# EAGLE design gflexgostack (EAGLE 6.5.0)
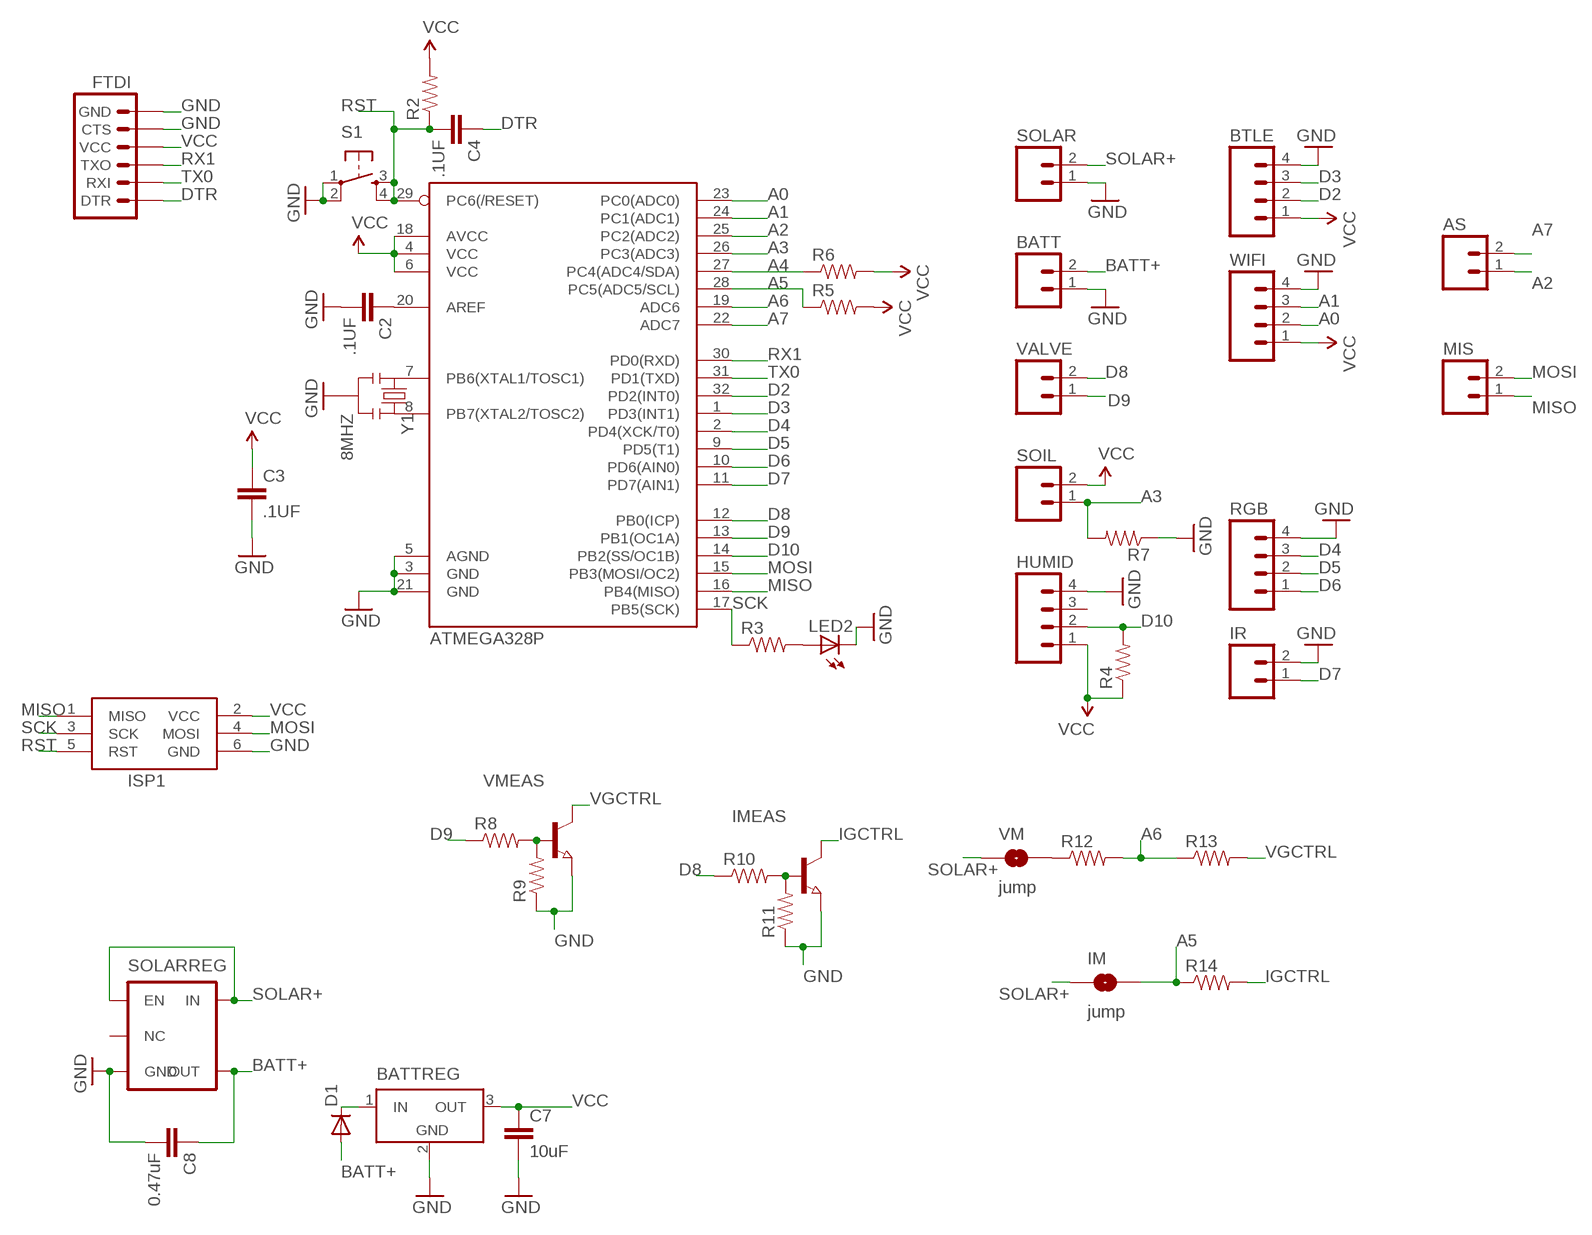
[diagram p0: schematic, sheet 1]

## Parts
AS  M02PTH  [1X02]
ATMEGA328P  ATMEGA168  [TQFP32-08]
BATT  M02PTH  [1X02]
BATTREG  LT1129CST5  [SOT223]
BTLE  M04PTH  [1X04]
C2  .1UF  .1UF-CER  [0402-CAP]
C3  .1UF  .1UF-CER  [0402-CAP]
C4  .1UF  .1UF-CER  [0402-CAP]
C7  10uF  .1UF-CER  [0402-CAP]
C8  0.47uF  .1UF-CER  [0402-CAP]
D1  DIODESMA  [SMA-DIODE]
FTDI  ARDUINO_SERIAL_PROGRAMPTH  [1X06]
HUMID  M04PTH  [1X04]
IM  jump  SOLDERJUMPERTRACE  [SJ_2S-TRACE]
IMEAS  NPN-TRANSISTOR_SOT23  [SOT23]
IR  M02PTH  [1X02]
ISP1  AVRISP-6  [AVRISP]
LED2  LED0603  [LED-0603]
MIS  M02PTH  [1X02]
R2  RESISTOR0603-RES  [0603-RES]
R3  RESISTOR0603-RES  [0603-RES]
R4  RESISTOR0603-RES  [0603-RES]
R5  RESISTOR0603-RES  [0603-RES]
R6  RESISTOR0603-RES  [0603-RES]
R7  RESISTOR0603-RES  [0603-RES]
R8  RESISTOR0603-RES  [0603-RES]
R9  RESISTOR0603-RES  [0603-RES]
R10  RESISTOR0603-RES  [0603-RES]
R11  RESISTOR0603-RES  [0603-RES]
R12  RESISTOR0603-RES  [0603-RES]
R13  RESISTOR0603-RES  [0603-RES]
R14  RESISTOR0603-RES  [0603-RES]
RGB  M04PTH  [1X04]
S1  TAC_SWITCHSMD  [TACTILE_SWITCH_SMD]
SOIL  M02PTH  [1X02]
SOLAR  M02PTH  [1X02]
SOLARREG  V_REG_MIC52195V  [SOT23-5]
VALVE  M02PTH  [1X02]
VM  jump  SOLDERJUMPERTRACE  [SJ_2S-TRACE]
VMEAS  NPN-TRANSISTOR_SOT23  [SOT23]
WIFI  M04PTH  [1X04]
Y1  8MHZ  RESONATOR8MHZ  [RESONATOR-SMD]

## Nets
A0: ATMEGA328P.23(PC0(ADC0)) WIFI.2
A1: ATMEGA328P.24(PC1(ADC1)) WIFI.3
A2: AS.1 ATMEGA328P.25(PC2(ADC2))
A3: ATMEGA328P.26(PC3(ADC3)) R7.2 SOIL.1
A4: ATMEGA328P.27(PC4(ADC4/SDA)) R6.1
A5: ATMEGA328P.28(PC5(ADC5/SCL)) IM.2 R5.1 R14.1
A6: ATMEGA328P.19(ADC6) R12.2 R13.1
A7: AS.2 ATMEGA328P.22(ADC7)
BATT+: BATT.2 C8.1 D1.A SOLARREG.4(OUT)
D2: ATMEGA328P.32(PD2(INT0)) BTLE.2
D3: ATMEGA328P.1(PD3(INT1)) BTLE.3
D4: ATMEGA328P.2(PD4(XCK/T0)) RGB.3
D5: ATMEGA328P.9(PD5(T1)) RGB.2
D6: ATMEGA328P.10(PD6(AIN0)) RGB.1
D7: ATMEGA328P.11(PD7(AIN1)) IR.1
D8: ATMEGA328P.12(PB0(ICP)) R10.1 VALVE.2
D9: ATMEGA328P.13(PB1(OC1A)) R8.1 VALVE.1
D10: ATMEGA328P.14(PB2(SS/OC1B)) HUMID.2 R4.2
DTR: C4.1 FTDI.1(DTR)
GND: ATMEGA328P.3(GND) ATMEGA328P.5(AGND) ATMEGA328P.21(GND) BATT.1 BATTREG.2(GND) BTLE.4 C2.2 C3.2 C7.2 C8.2 FTDI.5(CTS) FTDI.6(GND) HUMID.4 IMEAS.2(E) IR.2 ISP1.6(GND) LED2.C R7.1 R9.1 R11.1 RGB.4 S1.1 S1.2 SOLAR.1 SOLARREG.3(GND) VMEAS.2(E) WIFI.4 Y1.2
IGCTRL: IMEAS.3(C) R14.2
MISO: ATMEGA328P.16(PB4(MISO)) ISP1.1(MISO) MIS.1
MOSI: ATMEGA328P.15(PB3(MOSI/OC2)) ISP1.4(MOSI) MIS.2
N$1: ATMEGA328P.8(PB7(XTAL2/TOSC2)) Y1.3
N$2: ATMEGA328P.7(PB6(XTAL1/TOSC1)) Y1.1
N$3: R8.2 R9.2 VMEAS.1(B)
N$4: ATMEGA328P.20(AREF) C2.1
N$6: LED2.A R3.2
N$7: IMEAS.1(B) R10.2 R11.2
N$8: R12.1 VM.2
N$11: BATTREG.1(IN) D1.C
RST: ATMEGA328P.29(PC6(/RESET)) C4.2 ISP1.5(RST) R2.1 S1.3 S1.4
RX1: ATMEGA328P.30(PD0(RXD)) FTDI.3(TXO)
SCK: ATMEGA328P.17(PB5(SCK)) ISP1.3(SCK) R3.1
SOLAR+: IM.1 SOLAR.2 SOLARREG.1(EN) SOLARREG.5(IN) VM.1
TX0: ATMEGA328P.31(PD1(TXD)) FTDI.2(RXI)
VCC: ATMEGA328P.4(VCC) ATMEGA328P.6(VCC) ATMEGA328P.18(AVCC) BATTREG.3(OUT) BTLE.1 C3.1 C7.1 FTDI.4(VCC) HUMID.1 ISP1.2(VCC) R2.2 R4.1 R5.2 R6.2 SOIL.2 WIFI.1
VGCTRL: R13.2 VMEAS.3(C)
Unconnected: HUMID.3 SOLARREG.2(NC)

## Power pins joined to a net without a drawn wire
GND: BATTREG.4(GND)

## Library data of the parts
AS BATT IR MIS SOIL SOLAR VALVE = SparkFun-Connectors:M02: Standard 2-pin 0.1" header. Use with - straight break away headers ( PRT-00116) - right angle break away headers (PRT-00553) - swiss pins (PRT-00743) - machine pins (PRT-00117) - female headers (PRT-00115) Molex polarized connector foot print use with: PRT-08233 with associated crimp pins and housings. 2.54_SCREWTERM for use with PRT-10571. 3.5mm Screw Terminal footprints for PRT-08084 5mm Screw Terminal footprints for use with PRT-08433; DIGI: PPTC021LFBN-RC
ATMEGA328P = SparkFun-DigitalIC:ATMEGA168: Atmel 32-pin 8-bit micro, 16k flash.; DIGI: ATMEGA328P-AU
BATTREG = linear-technology:LT1129CST5: VOLTAGE REGULATOR with shutdown; DIGI: MCP1826S-3302E/DB; MPN: LT1129CST-3.3#PBF-ND; OC_FARNELL: 1663375; OC_NEWARK: 57M2069
BTLE HUMID RGB WIFI = SparkFun-Connectors:M04: Header 4 Standard 4-pin 0.1" header. Use with straight break away headers (SKU : PRT-00116), right angle break away headers (PRT-00553), swiss pins (PRT-00743), machine pins (PRT-00117), and female headers (PRT-00115). Molex polarized connector foot print use with SKU : PRT-08231 with associated crimp pins and housings. 1MM SMD Version SKU: PRT-10208; DIGI: PPTC041LFBN-RC
C2-C4 = SparkFun-Capacitors:.1UF-CER: .1uF ceramic SMT CAP-00810- 25V +80%/-20% (0603) CAP-08390- 100V 10% (0603) CAP-08604- 25V 5% (0603); DIGI: GRM155R71C104KA88D; PROD_ID: CAP-00810; VALUE: 0.1uF
C7 = SparkFun-Capacitors:.1UF-CER: .1uF ceramic SMT CAP-00810- 25V +80%/-20% (0603) CAP-08390- 100V 10% (0603) CAP-08604- 25V 5% (0603); DIGI: AMK105CBJ106MV-F; PROD_ID: CAP-00810; VALUE: 0.1uF
C8 = SparkFun-Capacitors:.1UF-CER: .1uF ceramic SMT CAP-00810- 25V +80%/-20% (0603) CAP-08390- 100V 10% (0603) CAP-08604- 25V 5% (0603); DIGI: GRM155R61A474KE15D; PROD_ID: CAP-00810; VALUE: 0.1uF
D1 = SparkFun-DiscreteSemi:DIODE: Diode These are standard reverse protection diodes and small signal diodes. SMA package can handle up to about 1A. SOD-323 can handle about 200mA. What the SOD-323 package when ordering, there are some mfgs out there that are 5-pin packages.; DIGI: B340A-13-F
FTDI = SparkFun-Connectors:ARDUINO_SERIAL_PROGRAM: FTDI connector footprints; DIGI: PPTC061LFBN-RC
IM VM = SparkFun-Passives:SOLDERJUMPER: Solder Jumper Standard SMD solder jumper. Used to automate production. Two varients : Normally Open and Normally Closed are the same, but have different paste layers. NC will have a large amount of paste and should jumper during reflow.
IMEAS VMEAS = semicon-smd-ipc:NPN-TRANSISTOR_: NPN TRANSISTOR
ISP1 = adafruit:AVRISP: AVR ISP HEADER Standard 6 pin header for AVR programming; DIGI: 961206-6404-AR
LED2 = SparkFun-LED:LED: LEDs Standard schematic elements and footprints for 5mm, 3mm, 1206, and 0603 sized LEDs. 5mm - Spark Fun Electronics SKU : COM-00529 (and others); DIGI: TLMG1100-GS08
R2 R4-R7 = SparkFun-Passives:RESISTOR: Resistor Basic schematic elements and footprints for 0603, 1206, and PTH resistors.; DIGI: ERJ-3GEYJ103V
R3 = SparkFun-Passives:RESISTOR: Resistor Basic schematic elements and footprints for 0603, 1206, and PTH resistors.; DIGI: ERJ-3GEYJ331V
R8 R10 = SparkFun-Passives:RESISTOR: Resistor Basic schematic elements and footprints for 0603, 1206, and PTH resistors.; DIGI: ERJ-3GEYJ431V
R9 R11 = SparkFun-Passives:RESISTOR: Resistor Basic schematic elements and footprints for 0603, 1206, and PTH resistors.; DIGI: ERJ-3GEYJ432V
R12 = SparkFun-Passives:RESISTOR: Resistor Basic schematic elements and footprints for 0603, 1206, and PTH resistors.; DIGI: ERJ-3GEYJ202V
R13 = SparkFun-Passives:RESISTOR: Resistor Basic schematic elements and footprints for 0603, 1206, and PTH resistors.; DIGI: ERJ-3GEYJ102V
R14 = SparkFun-Passives:RESISTOR: Resistor Basic schematic elements and footprints for 0603, 1206, and PTH resistors.; DIGI: ERJ-3RSJR10V
S1 = SparkFun-Electromechanical:TAC_SWITCH: Momentary Switch Button commonly used for reset or general input. Spark Fun Electronics SKU : COM-00097 SMT- SWCH-08247; DIGI: RS-187R05A2-DS MT RT; PROD_ID: SWCH-08247
SOLARREG = SparkFun-PowerIC:V_REG_MIC5219: V_REG MIC5219 Standard 3.3V and 5V 500mA LDO voltage regulator in SOT-23 layout. Micrel part MIC5219. BP (by-pass) pin is used to lower output noise with 470pF cap, may be left open.; DIGI: MIC5213-5.0YC5 TR; PROD_ID: VREG-10107; VALUE: MIC5219 5V
Y1 = SparkFun-FreqCtrl:RESONATOR: Resonator Small SMD resonator. Used, eg, on the Arduino Pro/ Pro Mini boards. 8MHz- XTAL-08895 16MHz- XTAL-08900; DIGI: PRQV8.00CR5010Y000; PROD_ID: XTAL-08895

## Board
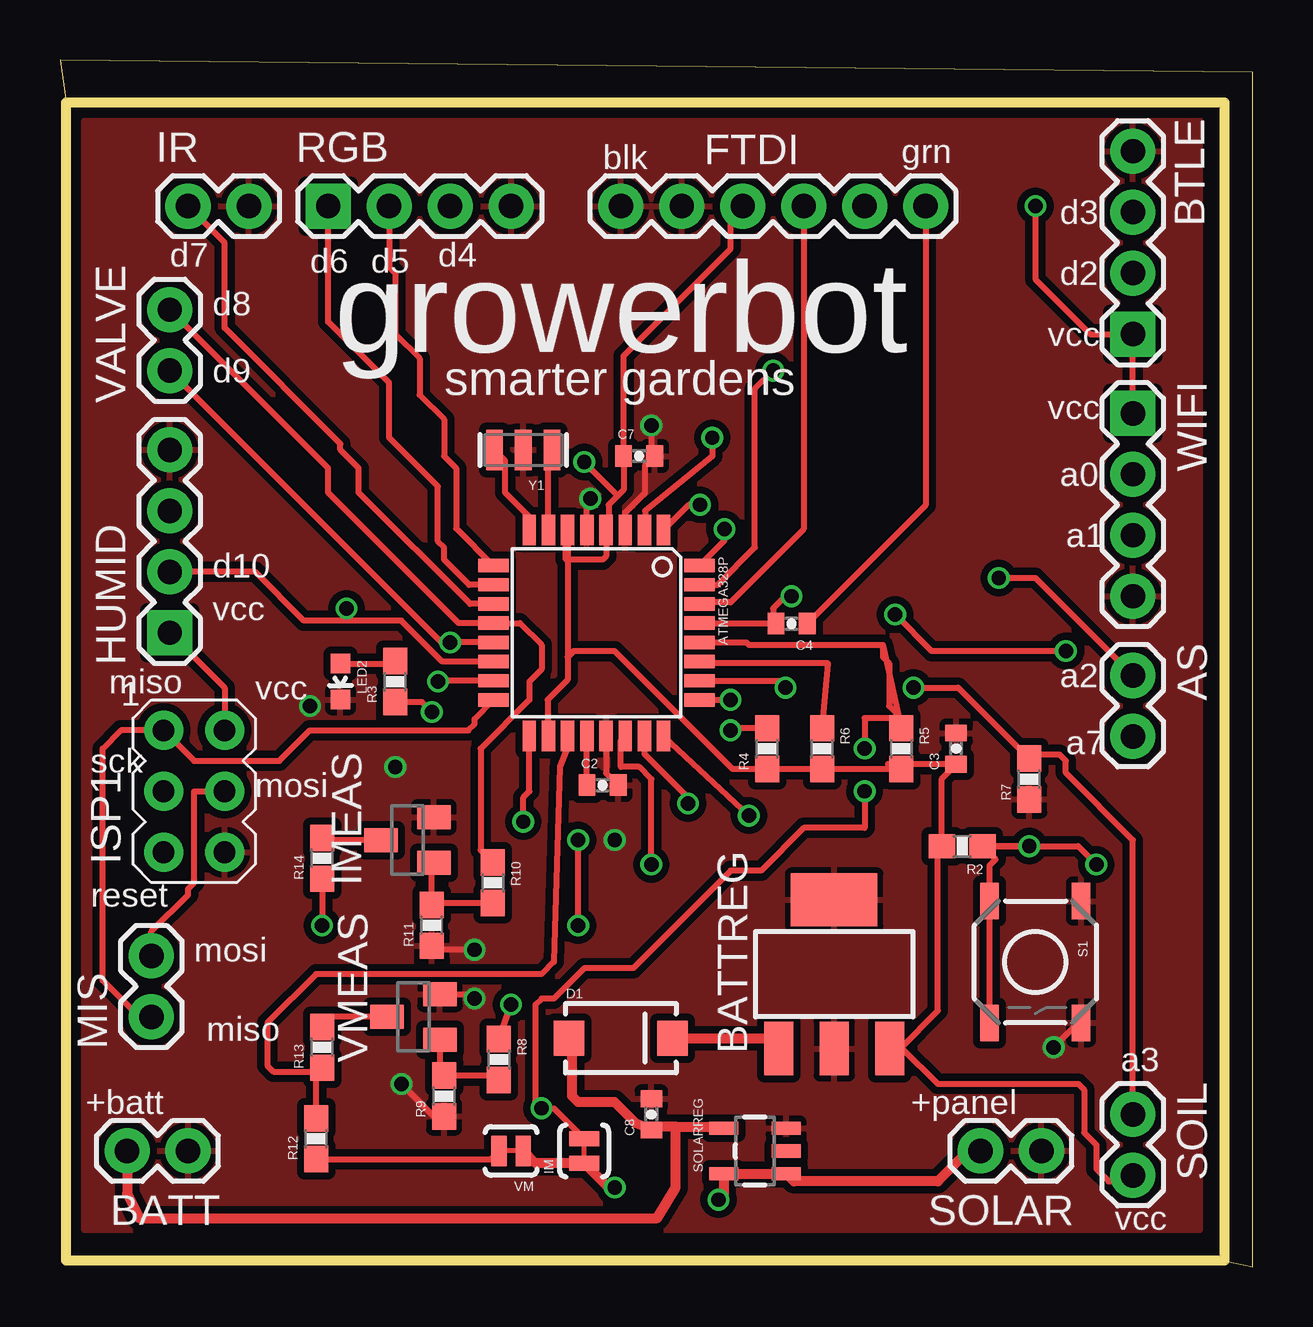
[diagram p1: board, top side]
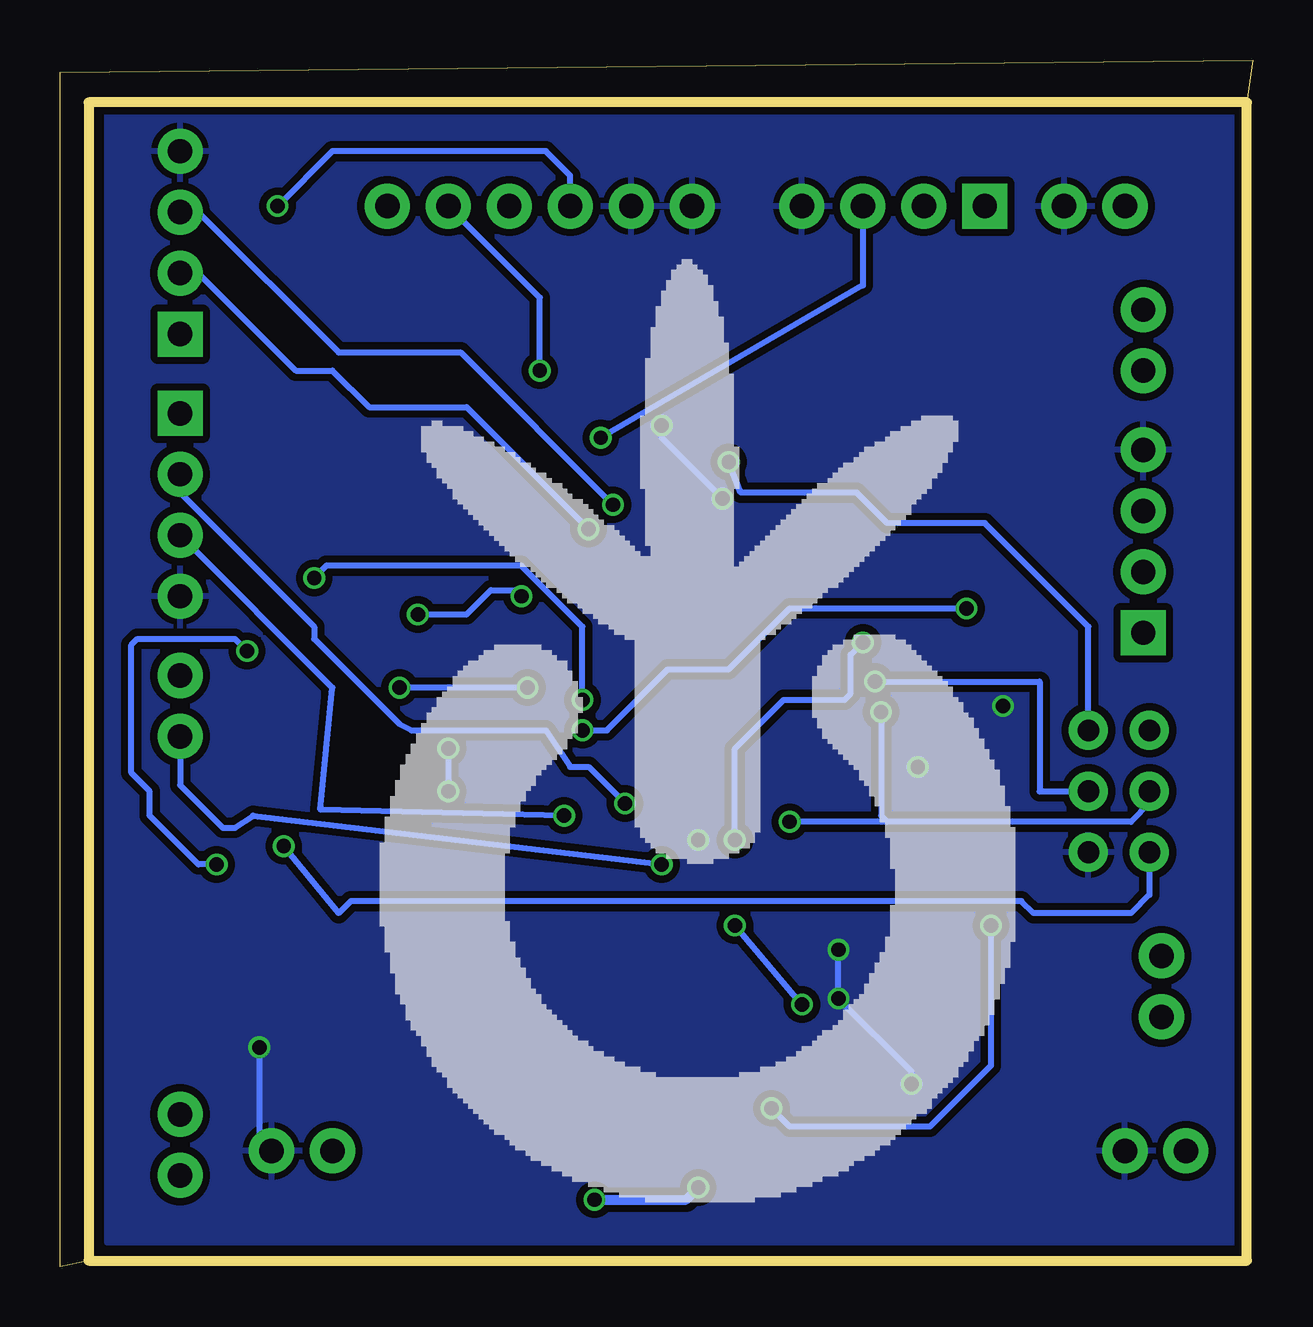
[diagram p2: board, bottom side, seen from below]

Size 49.71 x 50.28 mm. Coordinates in mm from the lower left corner, seen from the top.
Outline: 48.51,0.25 49.71,0 49.71,49.77 0,50.28 0.25,48.51
Outline: 0.25,48.51 0.25,0.25 48.51,0.25
Outline: 0.25,48.51 48.51,48.51 48.51,0.25
Copper layers (1*2*15*16): Top 0.035mm / dielectric 0.2mm / layer 2 0.0175mm / dielectric 1.1mm / layer 15 0.0175mm / dielectric 0.2mm / Bottom 0.035mm
Design rules "SeeedStudio_DRU_no_angle_20130527": minimum track width 6mil, minimum drill 12mil, track to track 6mil, track to pad 6mil, pad to pad 6mil, via to via 6mil, smd to smd 0mil, copper to edge 10mil, drill to drill 10mil, minimum pad ring 6mil, minimum via ring 6mil, stop-mask expansion 2mil, vias tented up to drill 25mil, thermal gap 10mil

### Footprints (pad centres in the part's own frame; a part is rotated, then mirrored left to right if it is on the bottom)
1X02 = drill 1.016 pad 1.88: 1 0,0; 2 2.54,0
TQFP32-08 = smd 1.27 x 0.559: 1 -4.293,2.8; 2 -4.293,2; 3 -4.293,1.2; 4 -4.293,0.4; 5 -4.293,-0.4; 6 -4.293,-1.2; 7 -4.293,-2; 8 -4.293,-2.8; 17 4.293,-2.8; 18 4.293,-2; 19 4.293,-1.2; 20 4.293,-0.4; 21 4.293,0.4; 22 4.293,1.2; 23 4.293,2; 24 4.293,2.8 | smd 0.559 x 1.27: 9 -2.8,-4.293; 10 -2,-4.293; 11 -1.2,-4.293; 12 -0.4,-4.293; 13 0.4,-4.293; 14 1.2,-4.293; 15 2,-4.293; 16 2.8,-4.293; 25 2.8,4.293; 26 2,4.293; 27 1.2,4.293; 28 0.4,4.293; 29 -0.4,4.293; 30 -1.2,4.293; 31 -2,4.293; 32 -2.8,4.293
SOT223 = smd 1.219 x 2.235: 1 -2.311,-3.099; 2 0,-3.099; 3 2.311,-3.099 | smd 3.6 x 2.2: 4 0,3.099
1X04 = drill 1.016 pad 1.88 square: 1 0,0 | drill 1.016 pad 1.88: 2 2.54,0; 3 5.08,0; 4 7.62,0
0402-CAP = smd 0.7 x 0.9: 1 -0.65,0; 2 0.65,0
SMA-DIODE = smd 1.27 x 1.47: A -2.15,0; C 2.15,0
1X06 = drill 1.016 pad 1.88: 1 0,0; 2 2.54,0; 3 5.08,0; 4 7.62,0; 5 10.16,0; 6 12.7,0
SJ_2S-TRACE = smd 0.635 x 1.27: 1 -0.508,0; 2 0.508,0
SOT23 = smd 1 x 1.4: 1 -0.95,-1.1; 2 0.95,-1.1; 3 0,1.1
AVRISP = drill 0.9 pad 1.626: 1 -1.27,2.54; 2 1.27,2.54; 3 -1.27,0; 4 1.27,0; 5 -1.27,-2.54; 6 1.27,-2.54
LED-0603 = smd 0.8 x 0.8: A 0,-0.75; C 0,0.75
0603-RES = smd 1.1 x 1: 1 -0.85,0; 2 0.85,0
TACTILE_SWITCH_SMD = smd 1.524 x 0.762: 1 -2.54,1.905; 2 2.54,1.905; 3 -2.54,-1.905; 4 2.54,-1.905
SOT23-5 = smd 0.55 x 1.2: 1 -0.95,-1.3; 2 0,-1.3; 3 0.95,-1.3; 4 0.95,1.3; 5 -0.95,1.3
RESONATOR-SMD = smd 0.7 x 1.7: 1 -1.2,0; 2 0,0; 3 1.2,0

### Placement (x,y rotation side)
AS  44.7,24.64 270 top
ATMEGA328P  22.35,26.42 270 top
BATT  5.33,4.83 180 top
BATTREG  32.26,12.19 0 top
BTLE  44.7,38.86 90 top
C2  22.61,20.07 0 top
C3  37.34,21.59 90 top
C4  30.48,26.8 180 top
C7  24.13,33.78 0 top
C8  24.64,6.35 90 top
D1  23.37,9.53 0 top
FTDI  36.07,44.2 180 top
HUMID  4.57,26.42 90 top
IM  21.84,4.83 90 top
IMEAS  14.48,17.78 90 top
IR  5.33,44.2 0 top
ISP1  5.59,19.81 0 top
LED2  11.68,24.38 180 top
MIS  3.81,10.41 90 top
R2  37.59,17.53 180 top
R3  13.97,24.38 90 top
R4  29.46,21.59 90 top
R5  35.05,21.59 270 top
R6  31.75,21.59 270 top
R7  40.39,20.32 90 top
R8  18.29,8.64 270 top
R9  16,7.11 90 top
R10  18.03,16 270 top
R11  15.49,14.22 90 top
R12  10.67,5.33 90 top
R13  10.92,9.14 90 top
R14  10.92,17.02 90 top
RGB  11.18,44.2 0 top
S1  40.64,12.7 270 top
SOIL  44.7,6.35 270 top
SOLAR  40.89,4.83 180 top
SOLARREG  28.96,4.83 90 top
U$1  [GLOGO]  9.14,1.27 0 top
VALVE  4.57,37.34 90 top
VM  18.8,4.83 180 top
VMEAS  14.73,10.41 90 top
WIFI  44.7,35.56 270 top
Y1  19.3,34.04 180 top

### Tracks (layer width: path | path; a pad name or v marks a point on that pad's centre or on a via)
A0  (via drill 0.6)
  Top 0.254: ATMEGA328P.23 24.35,21.37 26.16,19.56 v26.16,19.3
  Bottom 0.254: WIFI.2 44.7,32.26 39.12,26.67 39.12,26.16 35.56,22.61 35.05,22.35 29.46,22.35 28.45,20.83 27.69,20.83 v26.16,19.3
A1  (via drill 0.6)
  Top 0.254: ATMEGA328P.24 25.15,22.09 v28.7,18.8
  Bottom 0.254: v28.7,18.8 38.86,19.05 38.35,24.13 WIFI.3
A2  (via drill 0.6)
  Top 0.254: ATMEGA328P.25 v27.93,23.62 v27.94,23.62 | v39.12,28.7 40.64,28.7 AS.1
  Bottom 0.254: v27.94,23.62 27.94,26.67 30.48,29.21 38.61,29.21 v39.12,28.7
A3  (via drill 0.6)
  Top 0.254: SOIL.1 44.7,17.78 41.91,20.57 41.91,21.08 41.66,21.34 40.55,21.34 R7.2 37.43,24.13 v35.56,24.13 | ATMEGA328P.26 29.94,24.42 v30.23,24.13
  Bottom 0.254: v30.23,24.13 v35.56,24.13
A4
  Top 0.254: R6.1 32,25.15 26.71,25.15 ATMEGA328P.27
A5  (via drill 0.6)
  Top 0.254: R14.1 v10.92,14.22 | IM.2 20.57,6.6 v20.07,6.6 19.81,6.86 19.81,10.92 20.07,11.18 20.57,11.18 21.84,12.45 23.88,12.45 27.94,16.51 29.21,16.51 30.99,18.29 33.53,18.29 v33.53,19.81 | 34.29,25.91 R5.1 | ATMEGA328P.28 28.59,26.02 28.7,25.91 34.29,25.91 | 34.29,25.91 34.29,25.4 34.54,25.15 34.54,23.37 35.05,22.86 33.53,22.86 v33.53,21.59
  Bottom 0.254: v10.92,14.22 10.92,8.38 13.46,5.84 19.3,5.84 v20.07,6.6 | v33.53,21.59 v33.53,19.81
A6
  Top 0.254: R12.2 10.67,8.04 R13.1 10.76,8.13 8.89,8.13 8.64,8.38 8.64,10.16 10.67,12.19 20.07,12.19 20.57,12.7 20.83,20.83 21.15,21.66 ATMEGA328P.19
A7  (via drill 0.6)
  Top 0.254: v24.64,16.76 24.64,20.32 24.13,20.83 23.37,20.83 23.37,21.94 ATMEGA328P.22
  Bottom 0.254: AS.2 44.7,20.07 42.93,18.29 42.42,18.29 41.66,18.8 v24.64,16.76
BATT+
  Top 0.406: BATT.2 2.79,3.05 3.3,2.03 24.89,2.03 25.65,3.3 25.65,5.84 | 25.65,5.84 27.59,5.84 SOLARREG.4 | 25.65,5.84 24.78,5.84 C8.1 23.99,5.98 23.11,6.86 21.59,6.86 21.34,7.11 21.34,9.41 D1.A
D2  (via drill 0.6)
  Top 0.254: v27.69,30.73 27.69,30.26 ATMEGA328P.32
  Bottom 0.254: BTLE.2 43.94,41.4 39.88,37.34 38.35,37.34 36.83,35.81 32.77,35.81 v27.69,30.73
D3  (via drill 0.6)
  Top 0.254: v26.67,31.75 26.19,31.75 ATMEGA328P.1
  Bottom 0.254: BTLE.3 43.94,43.94 38.1,38.1 33.02,38.1 v26.67,31.75
D4  (via drill 0.6)
  Top 0.254: v27.18,34.54 27.18,33.78 24.38,31.5 24.38,30.74 ATMEGA328P.2
  Bottom 0.254: RGB.3 16.26,40.89 v27.18,34.54
D5
  Top 0.254: RGB.2 13.72,41.66 13.97,41.4 13.97,38.86 14.99,37.85 14.99,36.32 16,35.31 16,33.78 16.51,33.27 16.51,30.77 ATMEGA328P.9
D6
  Top 0.254: RGB.1 11.18,39.37 13.72,36.83 13.72,34.54 15.75,32.51 15.75,30.23 16,29.97 16,29.46 17.05,28.42 ATMEGA328P.10
D7
  Top 0.254: ATMEGA328P.11 17.09,27.62 12.45,32.26 12.45,33.27 11.68,34.04 11.68,34.29 6.86,39.12 6.86,42.67 IR.1
D8
  Top 0.254: VALVE.2 11.18,33.27 11.18,32.26 16.62,26.82 ATMEGA328P.12 19.16,26.82 20.07,25.91 20.07,24.89 19.56,24.38 19.56,23.62 17.53,21.59 17.53,17.36 R10.1
D9  (via drill 0.6)
  Top 0.254: ATMEGA328P.13 v16.26,26.02 15.89,26.02 VALVE.1 | R8.1 v18.8,10.92 | v21.59,14.22 v21.59,17.78
  Bottom 0.254: v18.8,10.92 v21.59,14.22 | v21.59,17.78 21.59,21.59 19.56,23.62 17.02,23.62 16.76,23.88 16.76,25.51 v16.26,26.02
D10  (via drill 0.6)
  Top 0.254: ATMEGA328P.14 15.93,25.22 14.22,26.92 11.94,26.92 | 11.94,26.92 10.16,26.92 8.13,28.96 HUMID.2 | R4.2 28.03,22.44 v27.94,22.35 | v11.94,27.43 11.94,26.92
  Bottom 0.254: v27.94,22.35 26.92,22.35 24.38,24.89 21.84,24.89 19.3,27.43 v11.94,27.43
DTR
  Top 0.254: FTDI.1 36.07,31.74 C4.1
GND  (via drill 0.6)
  Top 0.254: ATMEGA328P.21 22.75,20.57 C2.2 | S1.2 42.42,10.16 v41.4,9.14 | ATMEGA328P.3 23.55,31.43 24.38,32.26 24.38,33.39 C7.2 24.64,33.92 v24.64,35.05 | ATMEGA328P.5 21.95,31.86 v22.1,32 | VMEAS.2 17.08,11.36 v17.27,11.18 | v17.27,13.21 15.66,13.21 R11.1 | R9.1 15.58,6.26 v14.22,7.62
  Bottom 0.254: v41.4,9.14 41.4,5.33 SOLAR.1 | v22.1,32 24.64,34.54 v24.64,35.05 | v17.27,13.21 v17.27,11.18 14.22,8.13 v14.22,7.62
  other vias: 23.11,17.78 10.41,23.37 13.97,20.83
  pour Bottom (isolate 0.305): 0.76,48.01 47.75,48.01 47.75,1.02 0.76,1.02 0.76,6.6 0.76,47.75
  pour Top (isolate 0.305): 1.02,47.75 47.5,47.75 47.5,1.52 1.02,1.52 1.02,47.5
IGCTRL
  Top 0.254: IMEAS.3 11.01,17.78 R14.2
MISO
  Top 0.254: ATMEGA328P.16 17.27,22.83 17.27,22.61 17.02,22.35 10.41,22.35 9.14,21.08 5.59,21.08 ISP1.1 2.54,22.35 1.78,21.59 1.78,11.94 3.3,10.41 MIS.1
MOSI  (via drill 0.6)
  Top 0.254: MIS.2 3.81,13.97 5.33,15.49 5.33,15.75 5.59,16 5.59,19.81 ISP1.4 | ATMEGA328P.15 15.78,24.42 v15.75,24.38
  Bottom 0.254: v15.75,24.38 8.89,24.38 8.89,19.81 ISP1.4
N$1
  Top 0.254: ATMEGA328P.8 19.55,31.25 18.54,32.26 18.54,33.6 Y1.3
N$2
  Top 0.254: ATMEGA328P.7 20.35,33.88 Y1.1
N$3
  Top 0.254: VMEAS.1 15.83,8.13 R9.2 18.21,7.96 R8.2
N$4
  Top 0.254: C2.1 ATMEGA328P.20
N$6
  Top 0.254: LED2.A 13.87,25.13 R3.2
N$7
  Top 0.254: R10.2 15.57,15.15 R11.2 15.49,16.75 IMEAS.1
N$8
  Top 0.254: R12.1 17.95,4.48 VM.2
N$11
  Top 0.406: D1.C 29.52,9.53 BATTREG.1
RST  (via drill 0.6)
  Top 0.254: R2.1 38.99,16.98 38.73,16.73 S1.3 S1.4 | v40.39,17.53 R2.1 | ATMEGA328P.29 26.66,26.8 C4.2 29.72,26.91 29.72,27.43 30.23,27.94 v30.48,27.94 | R2.1 42.42,17.53 v43.18,16.76 | v41.91,25.65 36.32,25.65 v34.8,27.18
  Bottom 0.254: v40.39,17.53 38.1,14.73 37.59,15.24 9.65,15.24 9.14,14.73 5.08,14.73 4.32,15.49 ISP1.5 | v43.18,16.76 43.94,16.76 45.97,18.8 45.97,19.81 46.74,20.57 46.74,25.91 46.48,26.16 42.42,26.16 v41.91,25.65 | v34.8,27.18 32.77,27.18 31.75,28.19 30.73,28.19 v30.48,27.94
RX1
  Top 0.254: FTDI.3 30.99,30.73 27.94,27.69 26.71,27.69 ATMEGA328P.30
SCK  (via drill 0.6)
  Top 0.254: v19.3,18.54 19.3,19.56 19.56,19.81 ATMEGA328P.17 | R3.1 15.07,23.53 v15.49,23.11
  Bottom 0.254: ISP1.3 4.32,19.3 5.08,18.54 15.24,18.54 | 15.24,18.54 v19.3,18.54 | v15.49,23.11 15.49,18.8 15.24,18.54
SOLAR+  (via drill 0.6)
  Top 0.406: SOLAR.2 37.85,4.83 36.58,3.56 30.58,3.56 SOLARREG.1 SOLARREG.5 27.66,3.02 v27.43,2.79 | VM.1 19.81,4.32 IM.1 22.86,3.3 v23.11,3.3
  Bottom 0.406: v27.43,2.79 23.62,2.79 v23.11,3.3
TX0  (via drill 0.6)
  Top 0.254: ATMEGA328P.31 27.4,28.42 28.96,29.97 28.96,36.58 v29.72,37.34
  Bottom 0.254: v29.72,37.34 29.72,40.39 FTDI.2
VCC  (via drill 0.6)
  Top 0.254: SOIL.2 44.45,3.56 43.69,3.56 43.18,4.06 43.18,5.08 42.67,5.59 42.67,7.37 42.42,7.62 36.58,7.62 35.1,9.09 BATTREG.3 35,9.09 36.58,10.67 36.58,17.36 R2.2 36.74,20.34 C3.1 34.49,20.94 R5.2 R6.2 R4.1 28.03,20.74 23.11,25.65 21.41,25.65 21.15,25.4 | HUMID.1 6.86,24.13 ISP1.2 | 23.24,32.13 23.48,32.37 C7.1 23.48,37.96 27.94,42.42 27.94,43.69 FTDI.4 | 23.24,32.13 22.86,31.75 22.86,30.82 ATMEGA328P.4 22.75,29.61 22.61,29.46 21.08,29.46 21.08,30.64 ATMEGA328P.6 21.15,25.4 | 21.15,25.4 21.15,24.45 20.32,23.62 20.32,22.16 ATMEGA328P.18 | v21.84,33.53 23.24,32.13 | WIFI.1 BTLE.1 42.93,38.86 40.64,41.15 v40.64,44.2
  Bottom 0.254: ISP1.2 6.86,26.67 11.18,30.99 15.24,30.99 16.51,32.26 21.34,32.26 v21.84,33.53 | FTDI.4 28.45,45.47 29.46,46.48 38.35,46.48 v40.64,44.2
VGCTRL
  Top 0.254: VMEAS.3 11.34,10.41 R13.2

### Text on the board
tNames: grn | blk | d3 | d7 | d6 | d5 | d4 | d2 | d8 | growerbot | vcc | d9 | smarter gardens | vcc | a0 | a1 | d10 | vcc | miso | a2 | vcc | a7 | sck | mosi | reset | mosi | miso | a3 | +batt | +panel | vcc